# EAGLE design raspi-rfid-rc522 (EAGLE 7.7.0)
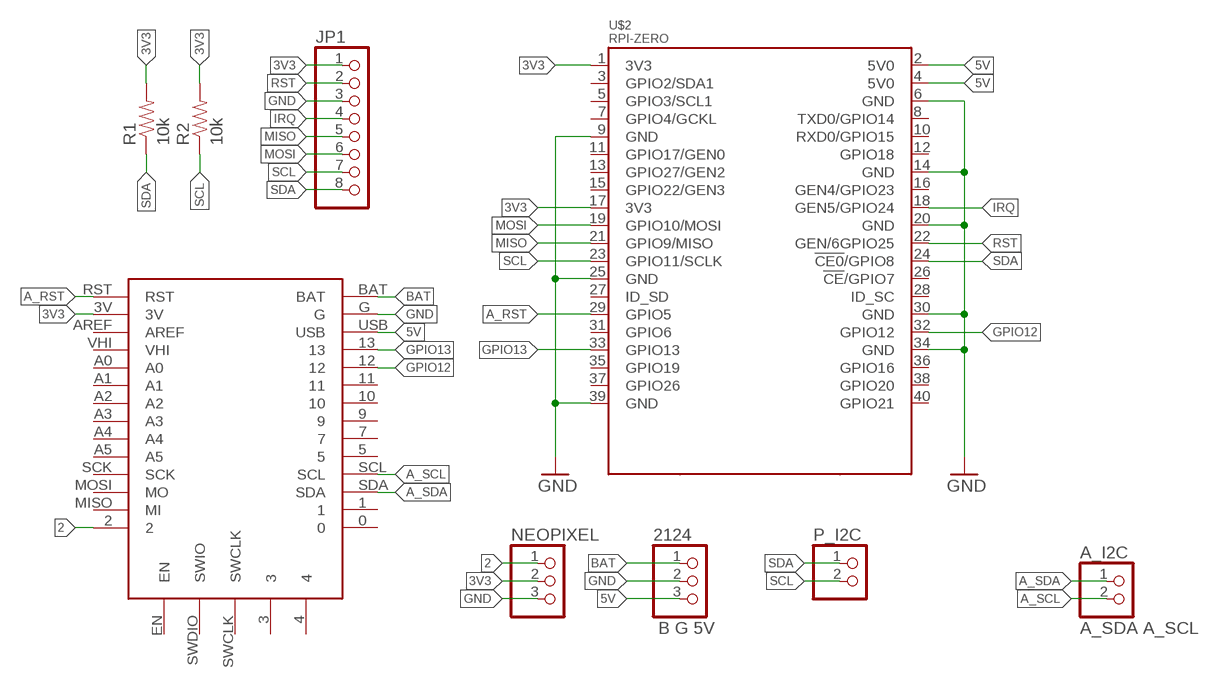
[diagram p0: schematic, sheet 1]

## Parts
2124  B G 5V  PINHD-1X3  [1X03]
A_I2C  A_SDA A_SCL  PINHD-1X2  [1X02]
JP1  PINHD-1X8/90  [1X08/90]
NEOPIXEL  PINHD-1X3  [1X03]
P_I2C  PINHD-1X2  [1X02]
R1  10k  RESISTOR0603-RES  [0603-RES]
R2  10k  RESISTOR0603-RES  [0603-RES]
U$1  ITSYBITSYM4  [ITSYBITSYM4]
U$2  RPI-ZERO  [RASPBERRYPI_BASTELSTUBE_V13_RASPI_BOARD_B+_FULL]

## Nets
2: NEOPIXEL.1 U$1.2
3V3: JP1.1 NEOPIXEL.2 R1.2 R2.2 U$1.3V U$2.1(3V3) U$2.17(3V3)
5V: 2124.3 U$1.USB U$2.2(5V0) U$2.4(5V0)
A_RST: U$1.RST U$2.29(GPIO5)
A_SCL: A_I2C.2 U$1.SCL
A_SDA: A_I2C.1 U$1.SDA
BAT: 2124.1 U$1.BAT
GND: 2124.2 JP1.3 NEOPIXEL.3 U$1.G U$2.6(GND) U$2.9(GND) U$2.14(GND) U$2.20(GND) U$2.25(GND) U$2.30(GND) U$2.34(GND) U$2.39(GND)
GPIO12: U$1.12 U$2.32(GPIO12)
GPIO13: U$1.13 U$2.33(GPIO13)
IRQ: JP1.4 U$2.18(GEN5/GPIO24)
MISO: JP1.5 U$2.21(GPIO9/MISO)
MOSI: JP1.6 U$2.19(GPIO10/MOSI)
RST: JP1.2 U$2.22(GEN/6GPIO25)
SCL: JP1.7 P_I2C.2 R2.1 U$2.23(GPIO11/SCLK)
SDA: JP1.8 P_I2C.1 R1.1 U$2.24(!CE0!/GPIO8)
Unconnected: U$1.0 U$1.1 U$1.3 U$1.4 U$1.5 U$1.7 U$1.9 U$1.10 U$1.11 U$1.A0 U$1.A1 U$1.A2 U$1.A3 U$1.A4 U$1.A5 U$1.AREF U$1.EN U$1.MISO(MI) U$1.MOSI(MO) U$1.SCK U$1.SWCLK U$1.SWDIO(SWIO) U$1.VHI U$2.3(GPIO2/SDA1) U$2.5(GPIO3/SCL1) U$2.7(GPIO4/GCKL) U$2.8(TXD0/GPIO14) U$2.10(RXD0/GPIO15) U$2.11(GPIO17/GEN0) U$2.12(GPIO18) U$2.13(GPIO27/GEN2) U$2.15(GPIO22/GEN3) U$2.16(GEN4/GPIO23) U$2.26(!CE!/GPIO7) U$2.27(ID_SD) U$2.28(ID_SC) U$2.31(GPIO6) U$2.35(GPIO19) U$2.36(GPIO16) U$2.37(GPIO26) U$2.38(GPIO20) U$2.40(GPIO21)

## Library data of the parts
2124 NEOPIXEL = pinhead:PINHD-1X3: PIN HEADER
A_I2C P_I2C = pinhead:PINHD-1X2: PIN HEADER
JP1 = pinhead:PINHD-1X8: PIN HEADER
R1 R2 = General:RESISTOR: Resistor Basic schematic elements and footprints for 0603, 1206, and PTH resistors.
U$1 = WhiteBoxOptical:ITSYBITSYM4
U$2 = RPI-Zero:RPI-ZERO

## Board
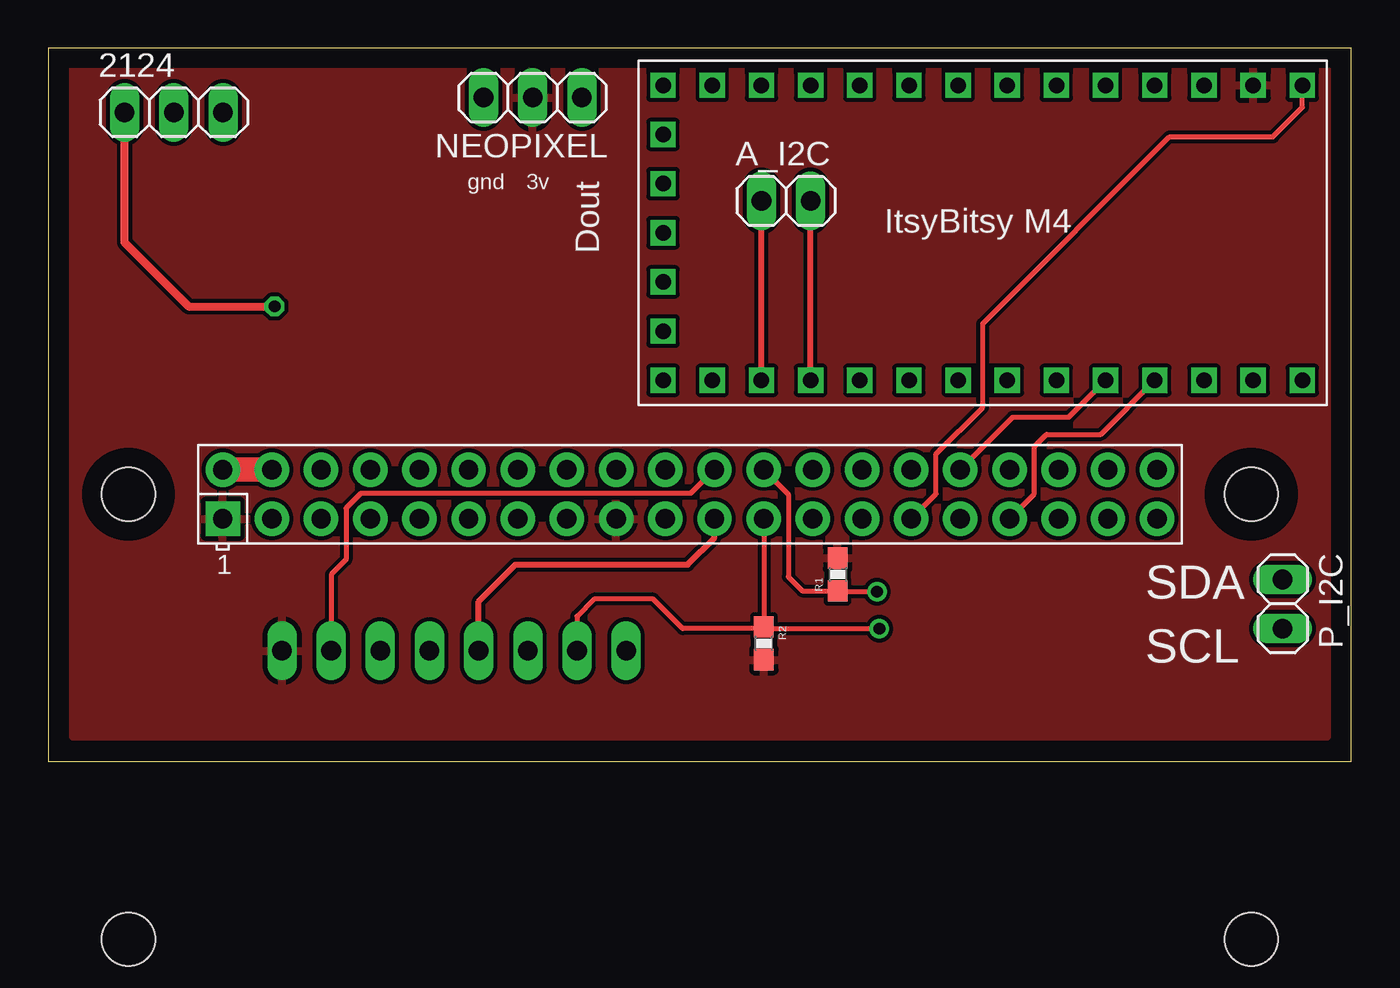
[diagram p1: board, top side]
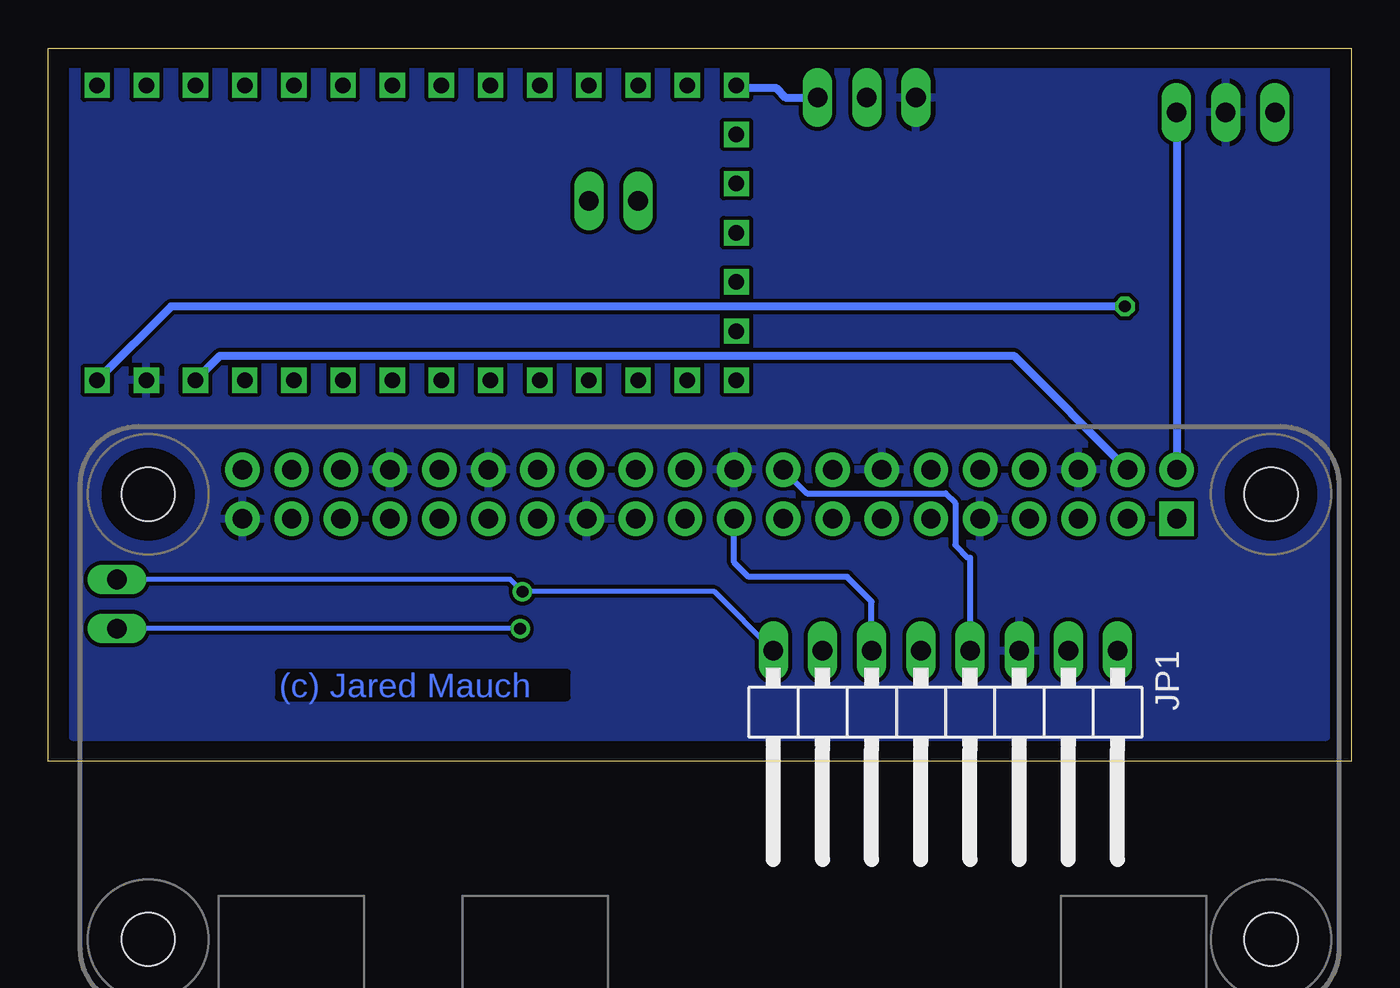
[diagram p2: board, bottom side, seen from below]

Size 67.29 x 36.83 mm. Coordinates in mm from the lower left corner, seen from the top.
Outline: 0,0 67.29,0 67.29,36.83 0,36.83 0,0
Copper layers (1*16): Top 0.035mm / dielectric 1.5mm / Bottom 0.035mm
Design rules "default": minimum track width 10mil, minimum drill 24mil, track to track 8mil, track to pad 8mil, pad to pad 8mil, via to via 8mil, smd to smd 8mil, copper to edge 40mil, drill to drill 8mil, minimum pad ring 10mil, minimum via ring 8mil, stop-mask expansion 4mil, vias tented up to drill 0mil, thermal gap 10mil

### Footprints (pad centres in the part's own frame; a part is rotated, then mirrored left to right if it is on the bottom)
1X03 = drill 1.016 long: 1 -2.54,0; 2 0,0; 3 2.54,0
1X02 = drill 1.016 long: 1 -1.27,0; 2 1.27,0
1X08/90 = drill 1.016 long: 1 -8.89,-3.81; 2 -6.35,-3.81; 3 -3.81,-3.81; 4 -1.27,-3.81; 5 1.27,-3.81; 6 3.81,-3.81; 7 6.35,-3.81; 8 8.89,-3.81
0603-RES = smd 1 x 1.1: 1 0,0.85; 2 0,-0.85
ITSYBITSYM4 = drill 0.8 square: 0 -16.51,-7.62; 1 -13.97,-7.62; 2 -16.51,7.62; 3 -16.51,-2.54; 3V 13.97,7.62; 4 -16.51,-5.08; 5 -6.35,-7.62; 7 -3.81,-7.62; 9 -1.27,-7.62; 10 1.27,-7.62; 11 3.81,-7.62; 12 6.35,-7.62; 13 8.89,-7.62; A0 6.35,7.62; A1 3.81,7.62; A2 1.27,7.62; A3 -1.27,7.62; A4 -3.81,7.62; A5 -6.35,7.62; AREF 11.43,7.62; BAT 16.51,-7.62; EN -16.51,5.08; G 13.97,-7.62; MISO -13.97,7.62; MOSI -11.43,7.62; RST 16.51,7.62; SCK -8.89,7.62; SCL -8.89,-7.62; SDA -11.43,-7.62; SWCLK -16.51,0; SWDIO -16.51,2.54; USB 11.43,-7.62; VHI 8.89,7.62
RASPBERRYPI_BASTELSTUBE_V13_RASPI_BOARD_B+_FULL = drill 1 pad 1.778 square: 1 8.37,25.23 | drill 1 pad 1.778: 2 8.37,27.77; 3 10.91,25.23; 4 10.91,27.77; 5 13.45,25.23; 6 13.45,27.77; 7 15.99,25.23; 8 15.99,27.77; 9 18.53,25.23; 10 18.53,27.77; 11 21.07,25.23; 12 21.07,27.77; 13 23.61,25.23; 14 23.61,27.77; 15 26.15,25.23; 16 26.15,27.77; 17 28.69,25.23; 18 28.69,27.77; 19 31.23,25.23; 20 31.23,27.77; 21 33.77,25.23; 22 33.77,27.77; 23 36.31,25.23; 24 36.31,27.77; 25 38.85,25.23; 26 38.85,27.77; 27 41.39,25.23; 28 41.39,27.77; 29 43.93,25.23; 30 43.93,27.77; 31 46.47,25.23; 32 46.47,27.77; 33 49.01,25.23; 34 49.01,27.77; 35 51.55,25.23; 36 51.55,27.77; 37 54.09,25.23; 38 54.09,27.77; 39 56.63,25.23; 40 56.63,27.77 | hole 2.75: 3.5,3.5; 3.5,26.5; 61.5,3.5; 61.5,26.5

### Placement (x,y rotation side)
2124  6.48,33.53 0 top
A_I2C  38.1,28.96 0 top
JP1  20.95,1.91 180 bottom
NEOPIXEL  25.02,34.29 180 top
P_I2C  63.75,8.13 270 top
R1  40.77,9.65 180 top
R2  36.96,6.1 0 top
U$1  48.26,27.3 0 top
U$2  0.64,-12.7 0 top

### Tracks (layer width: path | path; a pad name or v marks a point on that pad's centre or on a via)
2
  Bottom 0.406: U$1.2 31.62,34.8 29.72,34.8 29.21,34.29 NEOPIXEL.1
3V3
  pour Top: 1.27,36.2 66.04,36.2 66.04,1.27 1.27,1.27
5V
  Top 1.27: U$2.2 U$2.4
  Bottom 0.406: U$1.USB 58.42,20.95 17.43,20.95 U$2.4 | 2124.3 9.01,34.28 U$2.2
A_RST
  Top 0.254: U$2.29 45.85,13.81 45.85,15.88 48.26,18.29 48.26,22.61 57.91,32.26 63.25,32.26 64.77,33.78 U$1.RST
A_SCL
  Top 0.305: U$1.SCL A_I2C.2
A_SDA
  Top 0.305: U$1.SDA A_I2C.1
BAT  (via drill 0.6)
  Top 0.406: 2124.1 3.94,26.8 7.24,23.5 v11.68,23.5
  Bottom 0.406: U$1.BAT 60.96,23.5 v11.68,23.5
GND
  pour Bottom: 1.27,36.2 66.04,36.2 66.04,1.27 1.27,1.27
GPIO12
  Top 0.254: U$2.32 49.81,17.78 52.7,17.78 U$1.12
GPIO13
  Top 0.254: U$2.33 50.93,13.81 50.93,16.26 51.56,16.89 54.36,16.89 U$1.13
IRQ
  Bottom 0.305: JP1.4 19.68,10.51 19.78,10.51 20.45,11.18 20.45,13.34 20.95,13.84 28.1,13.84 U$2.18
MISO
  Top 0.305: JP1.5 22.23,8.26 24.13,10.16 33.02,10.16 34.41,11.54 U$2.21
MOSI
  Bottom 0.305: JP1.6 24.77,8.26 26.04,9.53 31.11,9.53 31.86,10.28 U$2.19
RST
  Top 0.254: U$2.22 33.18,13.84 16.13,13.84 15.37,13.08 15.37,10.41 14.61,9.65 JP1.2
SCL  (via drill 0.6)
  Top 0.254: U$2.23 36.96,12.52 R2.1 | R2.1 37.05,6.86 v42.93,6.86 | R2.1 36.87,6.86 32.77,6.86 31.24,8.38 28.19,8.38 27.3,7.49 JP1.7
  Bottom 0.254: v42.93,6.86 P_I2C.2
SDA  (via drill 0.6)
  Top 0.254: U$2.24 38.23,13.79 38.23,9.53 38.95,8.8 R1.1 40.81,8.76 v42.8,8.76
  Bottom 0.254: P_I2C.1 43.43,9.4 v42.8,8.76 32.89,8.76 JP1.8

### Text on the board
Bottom: (c) Jared Mauch
_tsilk: gnd | 3v | Dout | SDA | SCL